# Altium schematic sheet MCU.SchDoc
size A
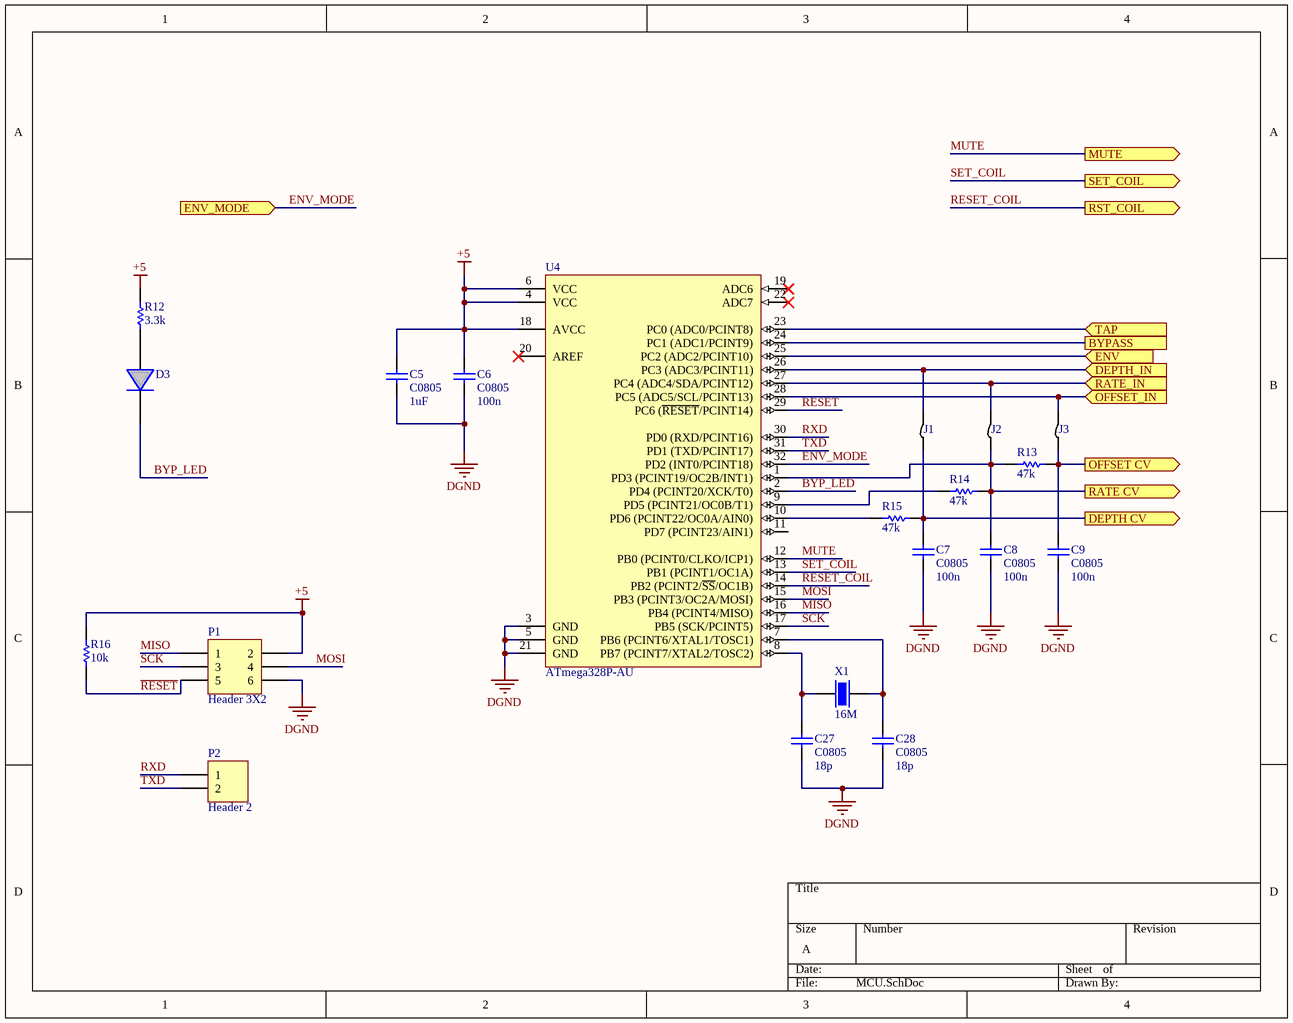
[diagram p0: MCU.SchDoc]

## Parts
C5  C0805  value 1uF  [0805]
C6  C0805  value 100n  [0805]
C7  C0805  value 100n  [0805]
C8  C0805  value 100n  [0805]
C9  C0805  value 100n  [0805]
C27  C0805  value 18p  [0805]
C28  C0805  value 18p  [0805]
D3  LED5MM  [LED5MM]  (value not drawn)
J1  Jumper  [Jumper]  (value not drawn)
J2  Jumper  [Jumper]  (value not drawn)
J3  Jumper  [Jumper]  (value not drawn)
P1  Header 3X2  [HDR2X3]
P2  Header 2  [HDR1X2]
R12  3.3k  [ERA-0805]
R13  47k  [ERA-0805]
R14  47k  [ERA-0805]
R15  47k  [ERA-0805]
R16  10k  [ERA-0805]
U4  ATmega328P-AU  [32A_N]
X1  16M  [XTAL PTH]

## Ports
BYPASS, DEPTH CV (out), DEPTH_IN (in), ENV (in), ENV_MODE (in), MUTE (out), OFFSET CV (out), OFFSET_IN (in), RATE CV (out), RATE_IN (in), RST_COIL (out), SET_COIL (out), TAP (in)

## Nets
+5: C5.2 C6.2 P1.2 R12.2 R16.2 U4.4(VCC) U4.6(VCC) U4.18(AVCC)
DGND: C5.1 C6.1 C7.1 C8.1 C9.1 C27.1 C28.1 P1.6 U4.3(GND) U4.5(GND) U4.21(GND)
BYP_LED: D3.1 U4.2(PD4_(PCINT20/XCK/T0))
BYPASS: U4.24(PC1_(ADC1/PCINT9)) ; port BYPASS
DEPTH CV: C7.2 J1.1 R15.2 ; port DEPTH CV
DEPTH_IN: J1.2 U4.26(PC3_(ADC3/PCINT11)) ; port DEPTH_IN
ENV: U4.25(PC2_(ADC2/PCINT10)) ; port ENV
ENV_MODE: U4.32(PD2_(INT0/PCINT18)) ; port ENV_MODE
MISO: P1.1 U4.16(PB4_(PCINT4/MISO))
MOSI: P1.4 U4.15(PB3_(PCINT3/OC2A/MOSI))
MUTE: U4.12(PB0_(PCINT0/CLKO/ICP1)) ; port MUTE
OFFSET CV: C9.2 J3.1 R13.2 ; port OFFSET CV
OFFSET_IN: J3.2 U4.28(PC5_(ADC5/SCL/PCINT13)) ; port OFFSET_IN
~{RESET}: P1.5 R16.1 U4.29(PC6_(~{RESET}/PCINT14))
RATE CV: C8.2 J2.1 R13.1 R14.2 U4.1(PD3_(PCINT19/OC2B/INT1)) ; port RATE CV
RATE_IN: J2.2 U4.27(PC4_(ADC4/SDA/PCINT12)) ; port RATE_IN
RESET_COIL: U4.14(PB2_(PCINT2/~{SS}/OC1B)) ; port RST_COIL
RXD: P2.1 U4.30(PD0_(RXD/PCINT16))
SCK: P1.3 U4.17(PB5_(SCK/PCINT5))
SET_COIL: U4.13(PB1_(PCINT1/OC1A)) ; port SET_COIL
TAP: U4.23(PC0_(ADC0/PCINT8)) ; port TAP
TXD: P2.2 U4.31(PD1_(TXD/PCINT17))
NetC27_2: C27.2 U4.8(PB7_(PCINT7/XTAL2/TOSC2)) X1.1
NetC28_2: C28.2 U4.7(PB6_(PCINT6/XTAL1/TOSC1)) X1.2
NetD3_0: D3.0 R12.1
NetR14_1: R14.1 U4.9(PD5_(PCINT21/OC0B/T1))
NetR15_1: R15.1 U4.10(PD6_(PCINT22/OC0A/AIN0))

Not connected (* = marked no-connect by the designer): U4 11(PD7_(PCINT23/AIN1)) 19(ADC6)* 20(AREF)* 22(ADC7)*

## Library data of the parts
C5-C9 C27 C28 = C0805: Ceramic Chip Capacitor - Standard; Note: Footprint corresponds to dimensions for bulk cassette packaging. This case size has tightened tolerances.; Published: 17-Jul-2002; LatestRevisionDate: 19-Mar-2004; LatestRevisionNote: Silkscreen size reduced.; DatasheetDocument: Mar-2001; PackageDocument: Mar-2001; PackageReference: 0805; Publisher: Altium Limited; Code_JEITA: 0805; Code_IPC: 2012[0805]; ComponentLink1Description: Manufacturer Link; ComponentLink1URL: http://www.kemet.com/; ComponentLink2Description: Datasheet; ComponentLink2URL: http://www.kemet.com/kemet/web/homepage/kechome.nsf/vapubfilesname/F3102TA.pdf/$file/F3102TA.pdf
P1 = Header 3X2: Header, 3-Pin, Dual row; LatestRevisionDate: 17-Jul-2002; LatestRevisionNote: Re-released for DXP Platform.; Publisher: Altium Limited
P2 = Header 2: Header, 2-Pin; LatestRevisionDate: 17-Jul-2002; LatestRevisionNote: Re-released for DXP Platform.; Publisher: Altium Limited
R12-R16 = ERAS: Resistor 0805; Note: If flow soldering, adjust pad width of PCB Footprint to 0.7 - 0.8 times the width of the resistor.; Published: 17-Dec-2003; LatestRevisionDate: 19-Mar-2004; LatestRevisionNote: Silkscreen size reduced.; PackageDocument: Mar-2003; PackageReference: ERA-0805; Publisher: Altium Limited; Code_IPC: 2012 [0805]; ComponentLink1Description: Manufacturer Link; ComponentLink1URL: http://www.panasonic.com/industrial/components/resistive_products.htm; ComponentLink2Description: Datasheet; ComponentLink2URL: http://www.panasonic.com/industrial/components/pdf/AOF0000CE1.pdf
U4 = ATmega328P-AU: 8-bit AVR Microcontroller, 32KB Flash, 1KB EEPROM, 2KB SRAM, 32-pin TQFP, Industrial Grade (-40°C to 85°C); Published: 1-Apr-2010; DatasheetVersion: revA, Jan-2010; PackageVersion: revB, Oct-2001; PackageReference: 32A; Publisher: Altium Limited; PackageDescription: 32-Lead, 7x7x1.0 mm Body, 0.8mm Lead Pitch, Thin Profile Plastic Quad Flat Package (TQFP); Supplier 1: Digi-Key; Supplier Part Number 1: ATMEGA328P-AU-ND; Supplier 2: Farnell; Supplier Part Number 2: 1715486; Supplier 3: Mouser; Supplier Part Number 3: 556-ATMEGA328P-AU; Code_JEDEC: MS-026-ABA; ComponentLink1Description: Manufacturer Link; ComponentLink1URL: http://www.atmel.com/products/avr/default.asp?; ComponentLink2Description: ATmega48A/48PA/88A/88PA/168A/168PA/328/328P Datasheet; ComponentLink2URL: http://www.atmel.com/dyn/resources/prod_documents/8271.pdf; ComponentLink3Description: ATmega48A/48PA/88A/88PA/168A/168PA/328/328P Summary; ComponentLink3URL: http://www.atmel.com/dyn/resources/prod_documents/8271S.pdf; ComponentLink4Description: Atmel.com Home; ComponentLink4URL: http://www.atmel.com
X1 = Crystal PTH: MPN: ECS-160-20-4X